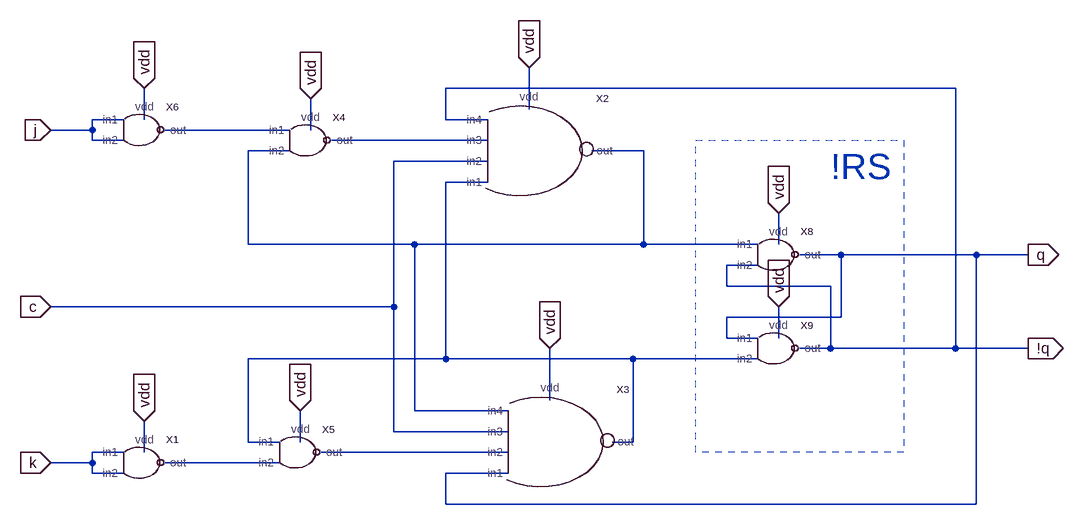
[diagram p0: schematic jk-trigger.asc]
jk-trigger.asc, the LTspice schematic file:
Version 4
SHEET 1 904 680
WIRE 704 -176 -80 -176
WIRE 48 -144 48 -208
WIRE -576 -128 -624 -128
WIRE -544 -128 -544 -176
WIRE -80 -128 -80 -176
WIRE -16 -128 -80 -128
WIRE -624 -112 -624 -128
WIRE -624 -112 -688 -112
WIRE -320 -112 -512 -112
WIRE -288 -112 -288 -160
WIRE -624 -96 -624 -112
WIRE -576 -96 -624 -96
WIRE -16 -96 -256 -96
WIRE -320 -80 -384 -80
WIRE 224 -80 144 -80
WIRE -16 -64 -160 -64
WIRE -16 -32 -80 -32
WIRE -384 64 -384 -80
WIRE -128 64 -384 64
WIRE 224 64 224 -80
WIRE 224 64 -128 64
WIRE 400 64 224 64
WIRE 432 64 432 16
WIRE 528 80 464 80
WIRE 736 80 528 80
WIRE 816 80 736 80
WIRE 400 96 352 96
WIRE 352 128 352 96
WIRE 512 128 352 128
WIRE -160 160 -160 -64
WIRE -160 160 -688 160
WIRE 528 176 528 80
WIRE 528 176 352 176
WIRE 352 208 352 176
WIRE 400 208 352 208
WIRE 432 208 432 160
WIRE 512 224 512 128
WIRE 512 224 464 224
WIRE 704 224 704 -176
WIRE 704 224 512 224
WIRE 816 224 704 224
WIRE -80 240 -80 -32
WIRE -80 240 -384 240
WIRE 208 240 -80 240
WIRE 400 240 208 240
WIRE 80 304 80 224
WIRE -128 320 -128 64
WIRE 16 320 -128 320
WIRE -160 352 -160 160
WIRE 16 352 -160 352
WIRE -384 368 -384 240
WIRE -336 368 -384 368
WIRE -304 368 -304 320
WIRE 208 368 208 240
WIRE 208 368 176 368
WIRE -576 384 -624 384
WIRE -544 384 -544 336
WIRE 16 384 -272 384
WIRE -624 400 -624 384
WIRE -624 400 -688 400
WIRE -336 400 -512 400
WIRE -624 416 -624 400
WIRE -576 416 -624 416
WIRE 16 416 -80 416
WIRE -80 464 -80 416
WIRE 736 464 736 80
WIRE 736 464 -80 464
FLAG -688 -112 j
IOPIN -688 -112 In
FLAG -688 160 c
IOPIN -688 160 In
FLAG -688 400 k
IOPIN -688 400 In
FLAG 816 80 q
IOPIN 816 80 Out
FLAG 816 224 !q
IOPIN 816 224 Out
FLAG 48 -208 vdd
IOPIN 48 -208 In
FLAG 80 224 vdd
IOPIN 80 224 In
FLAG -288 -160 vdd
IOPIN -288 -160 In
FLAG -304 320 vdd
IOPIN -304 320 In
FLAG -544 -176 vdd
IOPIN -544 -176 In
FLAG -544 336 vdd
IOPIN -544 336 In
FLAG 432 16 vdd
IOPIN 432 16 In
FLAG 432 160 vdd
IOPIN 432 160 In
SYMBOL nand4 16 -64 R0
SYMATTR InstName X2
SYMBOL nand4 48 384 R0
SYMATTR InstName X3
SYMBOL nand -304 -96 R0
SYMATTR InstName X4
SYMBOL nand -320 384 R0
SYMATTR InstName X5
SYMBOL nand 416 80 R0
SYMATTR InstName X8
SYMBOL nand 416 224 R0
SYMATTR InstName X9
SYMBOL nand -560 400 R0
SYMATTR InstName X1
SYMBOL nand -560 -112 R0
SYMATTR InstName X6
TEXT 512 -56 Left 5 ;!RS
RECTANGLE Normal 624 384 304 -96 2

The netlist it stands for:
* jk-trigger.asc
XX2 N004 c N002 !q N003 vdd nand4  ; pins in1 in2 in3 in4 out vdd
XX3 q N005 c N003 N004 vdd nand4  ; pins in1 in2 in3 in4 out vdd
XX4 N001 N003 N002 vdd nand  ; pins in1 in2 out vdd
XX5 N004 N006 N005 vdd nand  ; pins in1 in2 out vdd
XX8 N003 !q q vdd nand  ; pins in1 in2 out vdd
XX9 q N004 !q vdd nand  ; pins in1 in2 out vdd
XX1 k k N006 vdd nand  ; pins in1 in2 out vdd
XX6 j j N001 vdd nand  ; pins in1 in2 out vdd
* !RS
.backanno
.end